# Altium schematic sheet MAZ000182 - Diagrama eléctrico.SchDoc: MAZ000182 - Diagrama eléctrico
size A; ApprovedBy: Christian Ledwidth; CheckedBy: Nahuel Martinez; Author: Santiago Marti; CompanyName: Body Health; DrawnBy: Santiago Marti; Revision: A; SheetNumber: 1; SheetTotal: 2
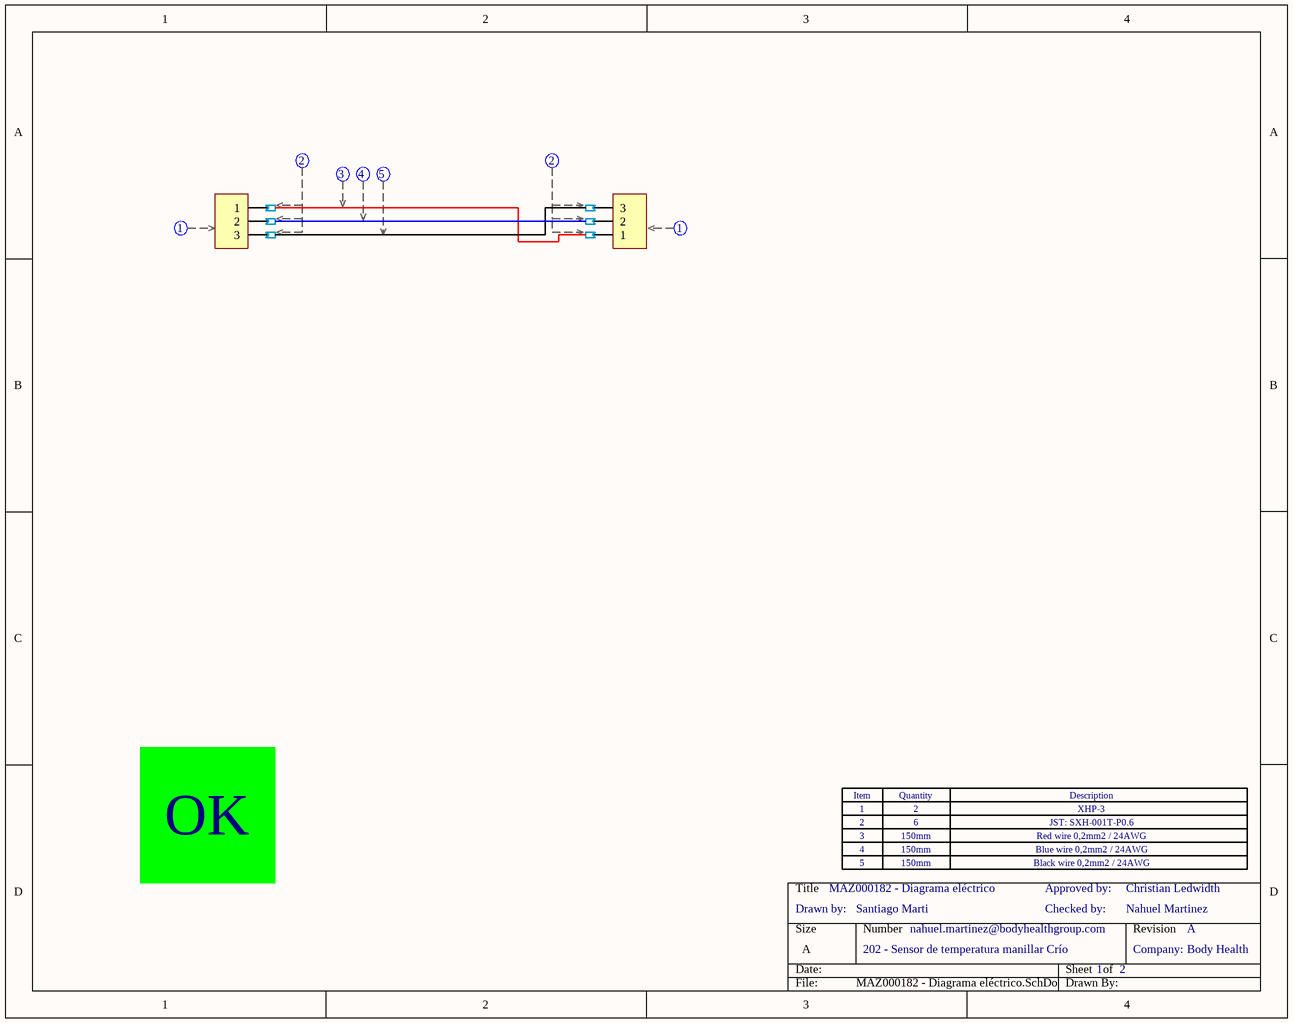
[diagram p0: MAZ000182 - Diagrama eléctrico.SchDoc]

## Parts
(Parts that share a designator on the sheet are numbered #1, #2 ... from top to bottom, then left to right.)
Cab1  Cable  (value not drawn)
Cab2  Cable  (value not drawn)
Cab3  Cable  (value not drawn)
Con1  XHP-4  (value not drawn)  (part C of 4)
Con2  CST-100-4  (value not drawn)  (part C of 4)
Con?#1  XHP-3  (value not drawn)  (part D of 4)
Con?#2  XHP-3  (value not drawn)  (part D of 4)
Soc1  sock_XHP_SXH-002T-P0.6  (value not drawn)  (parts A,B of 2)
Soc2  sock_CST_1375819-1  (value not drawn)  (part A of 2)
Soc3  sock_XHP_SXH-002T-P0.6  (value not drawn)  (part B of 2)
Soc4  sock_XHP_SXH-002T-P0.6  (value not drawn)  (part B of 2)
Soc5  sock_XHP_SXH-002T-P0.6  (value not drawn)  (part B of 2)
Soc6  sock_XHP_SXH-002T-P0.6  (value not drawn)  (part B of 2)
Soc8  sock_XHP_SXH-002T-P0.6  (value not drawn)  (part B of 2)
Zoc1  Zócalo_Header  (value not drawn)
Zoc2  Zócalo_Item  (value not drawn)
Zoc4  Zócalo_Item  (value not drawn)
Zoc6  Zócalo_Item  (value not drawn)
Zoc7  Zócalo_Item  (value not drawn)
Zoc8  Zócalo_Item  (value not drawn)

## Nets
NetCon?#1_1: Con?#1.1 Soc8.0
NetCon?#1_2: Con?#1.2 Soc6.0
NetCon?#1_3: Con?#1.3 Soc4.0
NetCon?#2_1: Con?#2.1 Soc1.0
NetCon?#2_2: Con?#2.2 Soc3.0
NetCon?#2_3: Con?#2.3 Soc5.0
NetSoc1_1: Soc1.1 Soc8.1
NetSoc3_1: Soc3.1 Soc6.1
NetSoc4_1: Soc4.1 Soc5.1

## Notes on the sheet
- OK
- 1
- 2
- 3
- 6
- 150mm
- XHP-3
- JST: SXH-001T-P0.6
- Red wire 0,2mm2 / 24AWG
- Drawn by:
- 4
- 5
- Checked by:
- Approved by:
- Blue wire 0,2mm2 / 24AWG
- Black wire 0,2mm2 / 24AWG
- 202 - Sensor de temperatura manillar Crío
- nahuel.martinez@bodyhealthgroup.com
- Company:
- (in symbol Zócalo_Header) Item; Quantity; Description

## Library data of the parts
Cab1 = Cable: CallOut: 3; Largo: *mm; Sección: 0,5mm2; Color: Red
Cab2 = Cable: CallOut: 4; Largo: *mm; Sección: 0,5mm2; Color: Pink
Cab3 = Cable: CallOut: 5; Largo: *mm; Sección: 0,5mm2; Color: Blue
Con1 = XHP-4: CONN HOUSING 2.5MM 4POS; Fabricante: JST Sales America Inc.; CallOut: 1; Cod.DigiKey: 455-2267-ND; Cod.Fabricante: XHP-4; ComponentLink1Description: Manufacturer Link; ComponentLink1URL: http://www.jst-mfg.com/product/pdf/eng/eXH.pdf; DIGIKEYx50: 0.06220; DIGIKEYx100: NO
Con2 = CST-100-4: CONN RCPT HSNG 4POS CST-100 II; Cod.Fabricante: 1375820-4; Fabricante: TE Connectivity AMP Connectors; CallOut: 1; Cod.DigiKey: A99615-ND; ComponentLink1Description: Manufacturer Link; ComponentLink1URL: https://www.te.com/commerce/DocumentDelivery/DDEController?Action=srchrtrv&DocNm=1375820&DocType=Customer+Drawing&DocLang=English; DIGIKEYx50: 0.18440; DIGIKEYx100: 0.17120
Con?#1 Con?#2 = XHP-3: CONN HOUSING 2.5MM 3POS; Fabricante: JST Sales America Inc.; Cod.DigiKey: 455-2219-ND; Cod.Fabricante: XHP-3; ComponentLink1Description: Manufacturer Link; ComponentLink1URL: http://www.jst-mfg.com/product/pdf/eng/eXH.pdf; DIGIKEYx50: 0.06220; CallOut: *; DIGIKEYx100: NO
Soc1 = sock_XHP_SXH-002T-P0.6: CONN SOCKET 26-30AWG CRIMP TIN; Fabricante: JST Sales America Inc.; CallOut: 2; Cod.DigiKey: 455-2261-1-ND; Cod.Fabricante: SXH-002T-P0.6; ComponentLink1Description: Manufacturer Link; ComponentLink1URL: http://www.jst-mfg.com/product/pdf/eng/eXH.pdf; DIGIKEYx100: 0.03300; DIGIKEYx50: 0.03420
Soc2 = sock_CST_1375819-1: CONN SOCKET 22-26AWG CRIMP TIN; Fabricante: TE Connectivity AMP Connectors; CallOut: 2; Cod.DigiKey: A100453CT-ND; Cod.Fabricante: 1375819-1; ComponentLink1Description: Manufacturer Link; ComponentLink1URL: https://www.te.com/commerce/DocumentDelivery/DDEController?Action=srchrtrv&DocNm=1375819&DocType=Customer+Drawing&DocLang=English; DIGIKEYx100: 0.04210; DIGIKEYx50: 0.03960
Soc3-Soc6 Soc8 = sock_XHP_SXH-002T-P0.6: CONN SOCKET 26-30AWG CRIMP TIN; Fabricante: JST Sales America Inc.; Cod.DigiKey: 455-2261-1-ND; Cod.Fabricante: SXH-002T-P0.6; ComponentLink1Description: Manufacturer Link; ComponentLink1URL: http://www.jst-mfg.com/product/pdf/eng/eXH.pdf; DIGIKEYx100: 0.03300; CallOut: *; DIGIKEYx50: 0.03420
Zoc1 = Zócalo_Header: Header para el zócalo de referencias
Zoc2 Zoc4 Zoc6-Zoc8 = Zócalo_Item: Ítem para el zócalo de referencias; Desginator: *; Quantity: *; ItemDescription: *